# Altium schematic sheet Esquematico.SchDoc
size A4; SheetNumber: 1; SheetTotal: 1
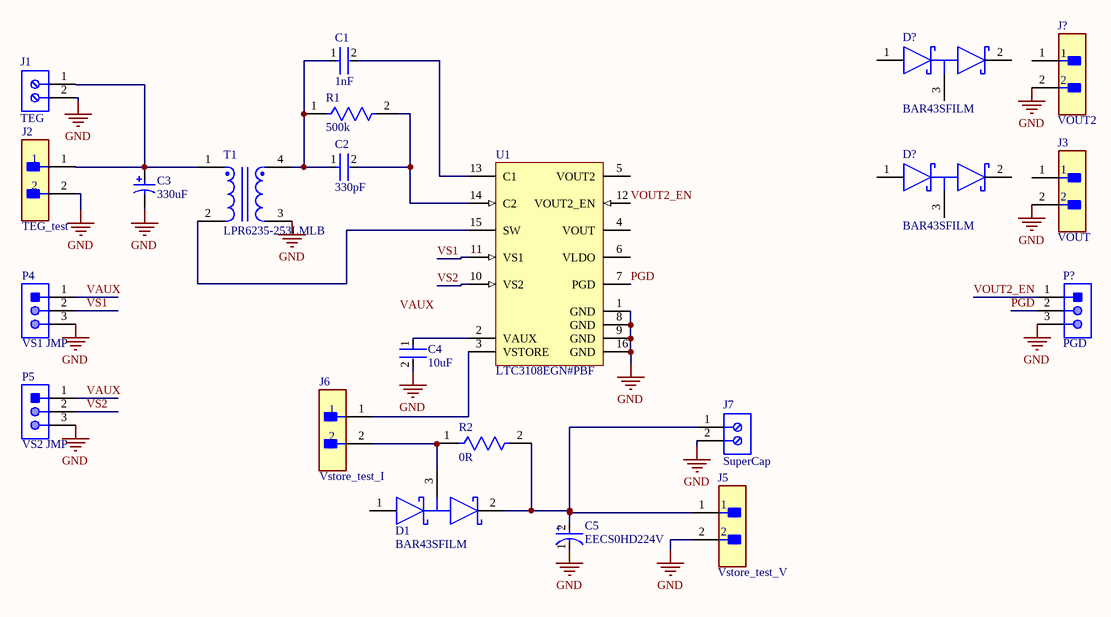
[diagram p0: Esquematico.SchDoc]

## Parts
(Parts that share a designator on the sheet are numbered #1, #2 ... from top to bottom, then left to right.)
C1  1nF  [FP-CL21-IPC_B]
C2  330pF  [FP-CL21-IPC_B]
C3  330uF  [PNSC-EEE-FK1V331P_L]
C4  10uF  [FP-CL21-IPC_B]
C5  EECS0HD224V  [FP-EECS0HD224V-MFG]
D1  BAR43SFILM  [FP-SOT23-3L-MFG]
D?#1  BAR43SFILM  [FP-SOT23-3L-MFG]
D?#2  BAR43SFILM  [FP-SOT23-3L-MFG]
J1  TEG  [691102710002]
J2  TEG_test  [FP-TSW-102-07-L-S-MFG]
J3  VOUT  [FP-TSW-102-07-L-S-MFG]
J5  Vstore_test_V  [FP-TSW-102-07-L-S-MFG]
J6  Vstore_test_I  [FP-TSW-102-07-L-S-MFG]
J7  SuperCap  [691102710002]
J?  VOUT2  [FP-TSW-102-07-L-S-MFG]
P4  VS1 JMP  [MOLX-22-28-4033_V]
P5  VS2 JMP  [MOLX-22-28-4033_V]
P?  PGD  [MOLX-22-28-4033_V]
R1  500k  [FP-RP732A-IPC_C]
R2  0R  [FP-RP732A-IPC_C]
T1  LPR6235-253LMLB  [FP-LPR6235-MFG]
U1  LTC3108EGN#PBF  [LT-GN-16_M]

## Nets
GND: C3.2 C4.2 C5.1(C) J1.2 J2.2 J3.2 J5.2 J7.2 J?.2 P4.3 P5.3 P?.3 T1.3 U1.1(GND) U1.8(GND) U1.9(GND) U1.16(GND)
PGD: P?.2 U1.7(PGD)
VAUX: P4.1 P5.1
VOUT2_EN: P?.1 U1.12(VOUT2_EN)
VS1: P4.2 U1.11(VS1)
VS2: P5.2 U1.10(VS2)
NetC1_1: C1.1 C2.1 R1.1 T1.4
NetC1_2: C1.2 U1.13(C1)
NetC2_2: C2.2 R1.2 U1.14(C2)
NetC3_1: C3.1 J1.1 J2.1 T1.1
NetC4_1: C4.1 U1.2(VAUX)
NetC5_2: C5.2(A) D1.2(K1) J5.1 J7.1 R2.2
NetD1_3: D1.3(A1/K2) J6.2 R2.1
NetJ6_1: J6.1 U1.3(VSTORE)
NetT1_2: T1.2 U1.15(SW)

Not connected (* = marked no-connect by the designer): D1 1(A2); D?#1 1(A2) 2(K1) 3(A1/K2); D?#2 1(A2) 2(K1) 3(A1/K2); J3 1; J? 1; U1 4(VOUT) 5(VOUT2) 6(VLDO)

## Notes on the sheet
- Labels drawn without touching a wire or pin: VAUX
- (in symbol CMP-05436-000001-1) +

## Library data of the parts
C1 C2 C4 = CMP-13271-001454-1: CL21 Series 0805 22uF 6.3V ±20% Tolerance X5R Multilayer Ceramic Chip Capacitor; Mount: Surface Mount; Voltage Rating: 6.3V; Capacitance: 22uF; Radiation Hardening: No; Thickness: 0.037inch; Packaging: Tape and Reel; Width: 0.049inch; Tolerance: 20%; Case Code (Imperial): 0805; Dielectric: X5R; Case Code (Metric): 2012; Package Quantity: 1; Lead Free: Lead Free; Case/Package: 0805; Min Operating Temperature: -55°C; Depth: 1.25mm; Length: 2mm; Height: 0.85mm; Max Operating Temperature: 85°C
C3 = CMP-2000-06212-1: Aluminum Electrolytic Capacitor, 330 uF, 35 V, -55 to 105 degC, 2-Pin CAPAE, RoHS, Tape and Reel; Manufacturer: Panasonic; Capacitance: 330µF; Type: Can; Impedance: 0.08O; Ripple Current: 850mA; Lifetime@Temperature: 2000Hrs@105°C; Rated Voltage: 35V; Datasheet Version: 07/2008; Manufacturer URL: http://www.panasonic.com/; Package Description: 2-Pin Capacitor Aluminum Electrolytic, Body 10.3 x 10.3 mm, Height 10.5 mm; Case Size/Dimension: Ø10x10.2mm; Datasheet URL: https://datasheet.ciiva.com/29313/443481-da-01-en-smd-elko-vfk-g-330-uf-35v-29313592.pdf; Series: FK; Mounting Technology: SurfaceMount; Package Reference: EEE-FK1V331P; Operating Temp-Max: 105°C; Operating Temp Range: -55to+105°C
C5 = CMP-05436-000001-1: CAP 220MF -20% +80% 5.5V T/H; Lead Diameter: 0.8mm; Dielectric Material: Aluminium; Life (Hours): 1000Hour; Body Diameter: 10.5mm; Tolerance: 80%; ESR (Equivalent Series Resistance): 75R; Voltage: 500V; Lead Length: 3mm; Case/Package: Radial; RoHS Compliant: Yes; Package Quantity: 200; Radiation Hardening: No; Length: 11.5mm; Voltage Rating: 5.5V; Capacitance: 220mF; Series: SD; Voltage Rating (DC): 5.5V; Width: 5mm; Mount: Through Hole; Min Operating Temperature: -25°C; Height - Seated (Max): 0.453inch; Diameter: 10.5mm; Lead Free: Lead Free; Termination: Through Hole; Max Operating Temperature: 70°C; Packaging: Bulk; Height: 11.5mm; Lead Pitch: 5mm; REACH SVHC: No SVHC; Depth: 5mm; Construction: Cylindrical
D1 D?#1 D?#2 = CMP-2000-05915-2: DIODE ARRAY SCHOTTKY 30V SOT23-3; Manufacturer: STMicroelectronics; Forward Current: 0.1A; Peak Reverse Current: 0.5uA; Standoff Height: 0mm; Value: 7pF; Max Junction Temp: +150°C; Max Surge Forward Current: 0.75A; Max Repetitive Reverse Voltage: 30V; ComponentLink2Description: Datasheet; Mouser Description: Schottky Diodes & Rectifiers 100mA 30 Volt; Octopart: https://octopart.com/bar43sfilm-stmicroelectronics-39549077; Temperature: to +150°C; Category: Diode; Lead Free: Yes; Device Class L3: Schottky Diodes; Device Class L1: Discrete Semiconductors; Manufacturer Part Number: BAR43SFILM; RoHS: TRUE; ComponentLink2URL: https://www.st.com/resource/en/datasheet/bar43.pdf; Device Class L2: Diodes; Package: SOT23-3L; Height: 1.5mm; Automotive: No; Capacitance: 7pF; Temperature Range High: +150°C; Digikey Description: DIODE ARRAY SCHOTTKY 30V SOT23-3
J1 J7 = CMP-1502-03258-1: Series 102 - 5.00 mm Horizontal Entry Modular with Pressure Clamp WR-TBL, 2 pin; Manufacturer: Wurth Elektronik; Pin Number: 2; Pitch: 5.00mm; Manufacturer URL: http://www.we-online.de; Mounting Technology: THT; Publisher: WurthElektronik; Packaging: Box; Package Reference: 691102710002; Datasheet URL: http://katalog.we-online.de/em/datasheet/6911027100xx.pdf; Operating Temperature: -40to105degC; Part Number: 691102710002
J2 J3 J5 J6 J? = CMP-02766-001428-1: CONN HEADER VERT 2POS 2.54MM; Voltage Rating: 550V; Current Rating: 7.6A; Gender: Male; Number of Contacts: 2; Connector Type: Male Pin; Radiation Hardening: No; Orientation: Straight; Contact Plating: Gold; Max Operating Temperature: 125°C; Mount: Through Hole; Package Quantity: 1; Number of Rows: 1; Housing Material: Polyester; RoHS Compliant: Yes; Length: 5.08mm; Max Voltage Rating (AC): 550V; Pitch: 2.54mm; Packaging: Bulk; Depth: 2.54mm; Termination: Solder; Min Operating Temperature: -55°C; Housing Color: Black; Lead Free: Lead Free; Color: Black; Number of Positions: 2; Width: 2.54mm; Max Current Rating: 7.6A; REACH SVHC: No SVHC; Contact Material: Bronze; Contact Mating Length: 0.23inch; Series: TSW; Contact Type: Male Pin
P4 P5 P? = CMP-1676-00001-5: Male Header, Pitch 2.54 mm, 1 x 3 Position, Height 8.38 mm, Tail Length 3.18 mm, RoHS, Bulk; Manufacturer: Molex; Rows: 1; Voltage Rating: 250 V; Current Rating: 4 A; Min Operating Temperature: 0 degC; Lead Pitch: 0.1 inch; Packaging: Bulk; Contact Finish: Gold; RoHSCompliant: true; Contact Material: Brass; PackageReference: 22-28-4033; REACH SVHC: Unknown; PackageDescription: Male Header, Pitch 2.54 mm, 1 x 3 Position, Height 8.38 mm, Tail Length 3.18 mm; ComponentLink2URL: http://www.molex.com/pdm_docs/sd/022284033_sd.pdf; Height: 8.38 mm; Mounting Technology: Through Hole; ComponentLink1Description: Manufacturer URL; Length: 7.62 mm; Mount: Through Hole; DatasheetVersion: Rev. G, 01/2012; Max Operating Temperature: 75 degC; ComponentLink2Description: Datasheet; Colour: Black; Pins: 3; Contact Plating: Gold; Package Quantity: 1; ComponentLink1URL: http://www.molex.com/
R1 R2 = CMP-03211-009539-2: Surface Mount Resistors, Precision Resistor, 2 Terminations, Size Code 0805, Cut Tape Length, .1%, Thin Film, 10K 0.1% 10PPM; Voltage Rating: 150V; Resistance: 39.2kR; Power Rating: 125mW; Number of Resistors: 1; Temperature Coefficient: 15ppm/°C; Case Code (Metric): 2012; Width: 1.25mm; Height: 0.55mm; Case Code (Imperial): 0805; Packaging: Tape and Reel; Weight: 0.000194oz; Tolerance: 0.1%; Max Operating Temperature: 155°C; ELV: Compliant; Length: 2mm; Mount: Surface Mount; Package Quantity: 1000; Case/Package: 0805; Min Operating Temperature: -55°C; Number of Terminations: 2; Termination: Solder
T1 = CMP-11284-000017-1: Coupled Inductors Mini Step-up Xfmr SEE PART COMMENT TAB; Manufacturer: Coilcraft; Sec Resistance: 13.7Ω; Isolation Voltage: 300Vrms; Primary Resistance: 0.74Ω; Turns Ratio: 1:10; Inductance Primary: 25uH; Frequency: 100kHz; Device Class L3: unset; Device Class L1: Passive Components; RoHS: TRUE; Height: 3.5mm; ComponentLink2Description: Datasheet; Lead Free: Yes; ComponentLink2URL: https://www.coilcraft.com/pdfs/lpr6235.pdf; Device Class L2: Transformers; Ambient Temperature Range High: +85°C; Automotive: No; Package: LPR6235; Manufacturer Part Number: LPR6235-253LMLB; Mouser Description: Coupled Inductors Mini Step-up Xfmr SEE PART COMMENT TAB; Category: Trans; Ambient Temperature Range Low: -40°C; Octopart: https://octopart.com/lpr6235-253lmlb-coilcraft-14935593
U1 = CMP-0473-00093-1: Ultralow Voltage Step-Up Converter and Power Manager, 16-pin SOP (GN-16), -40 to 125 degC, Pb-Free; Manufacturer: Linear Technology; Energy Source: Thermoelectric; Vin Max(V): 0.5; Vin Min(V): 0.02; Topology: Boost, LDO; Number of Outputs: 3; Vout Max(V): 5; DatasheetVersion: Rev. B; ComponentLink3Description: Package Specification; ComponentLink1URL: http://www.linear.com/; ComponentLink2Description: Datasheet; ComponentLink2URL: http://cds.linear.com/docs/en/datasheet/3108fb.pdf; PackageVersion: Rev. B, 03/2012; RoHS: TRUE; ComponentLink3URL: http://cds.linear.com/docs/en/packaging/05081641_B_GN16.pdf; PartNumber: LTC3108EGN#PBF; ComponentLink1Description: Manufacturer URL; PackageReference: GN-16; PackageDescription: 16-Pin Plastic SSOP, Body 4.9 x 3.9 mm, Pitch 0.635 mm; Mounting Technology: Surface Mount